# EasyEDA Pro project 2022年第十三届立创EDA出品模拟题.eprj

# Schematic 【蓝桥杯练习题一】51单片机开发板
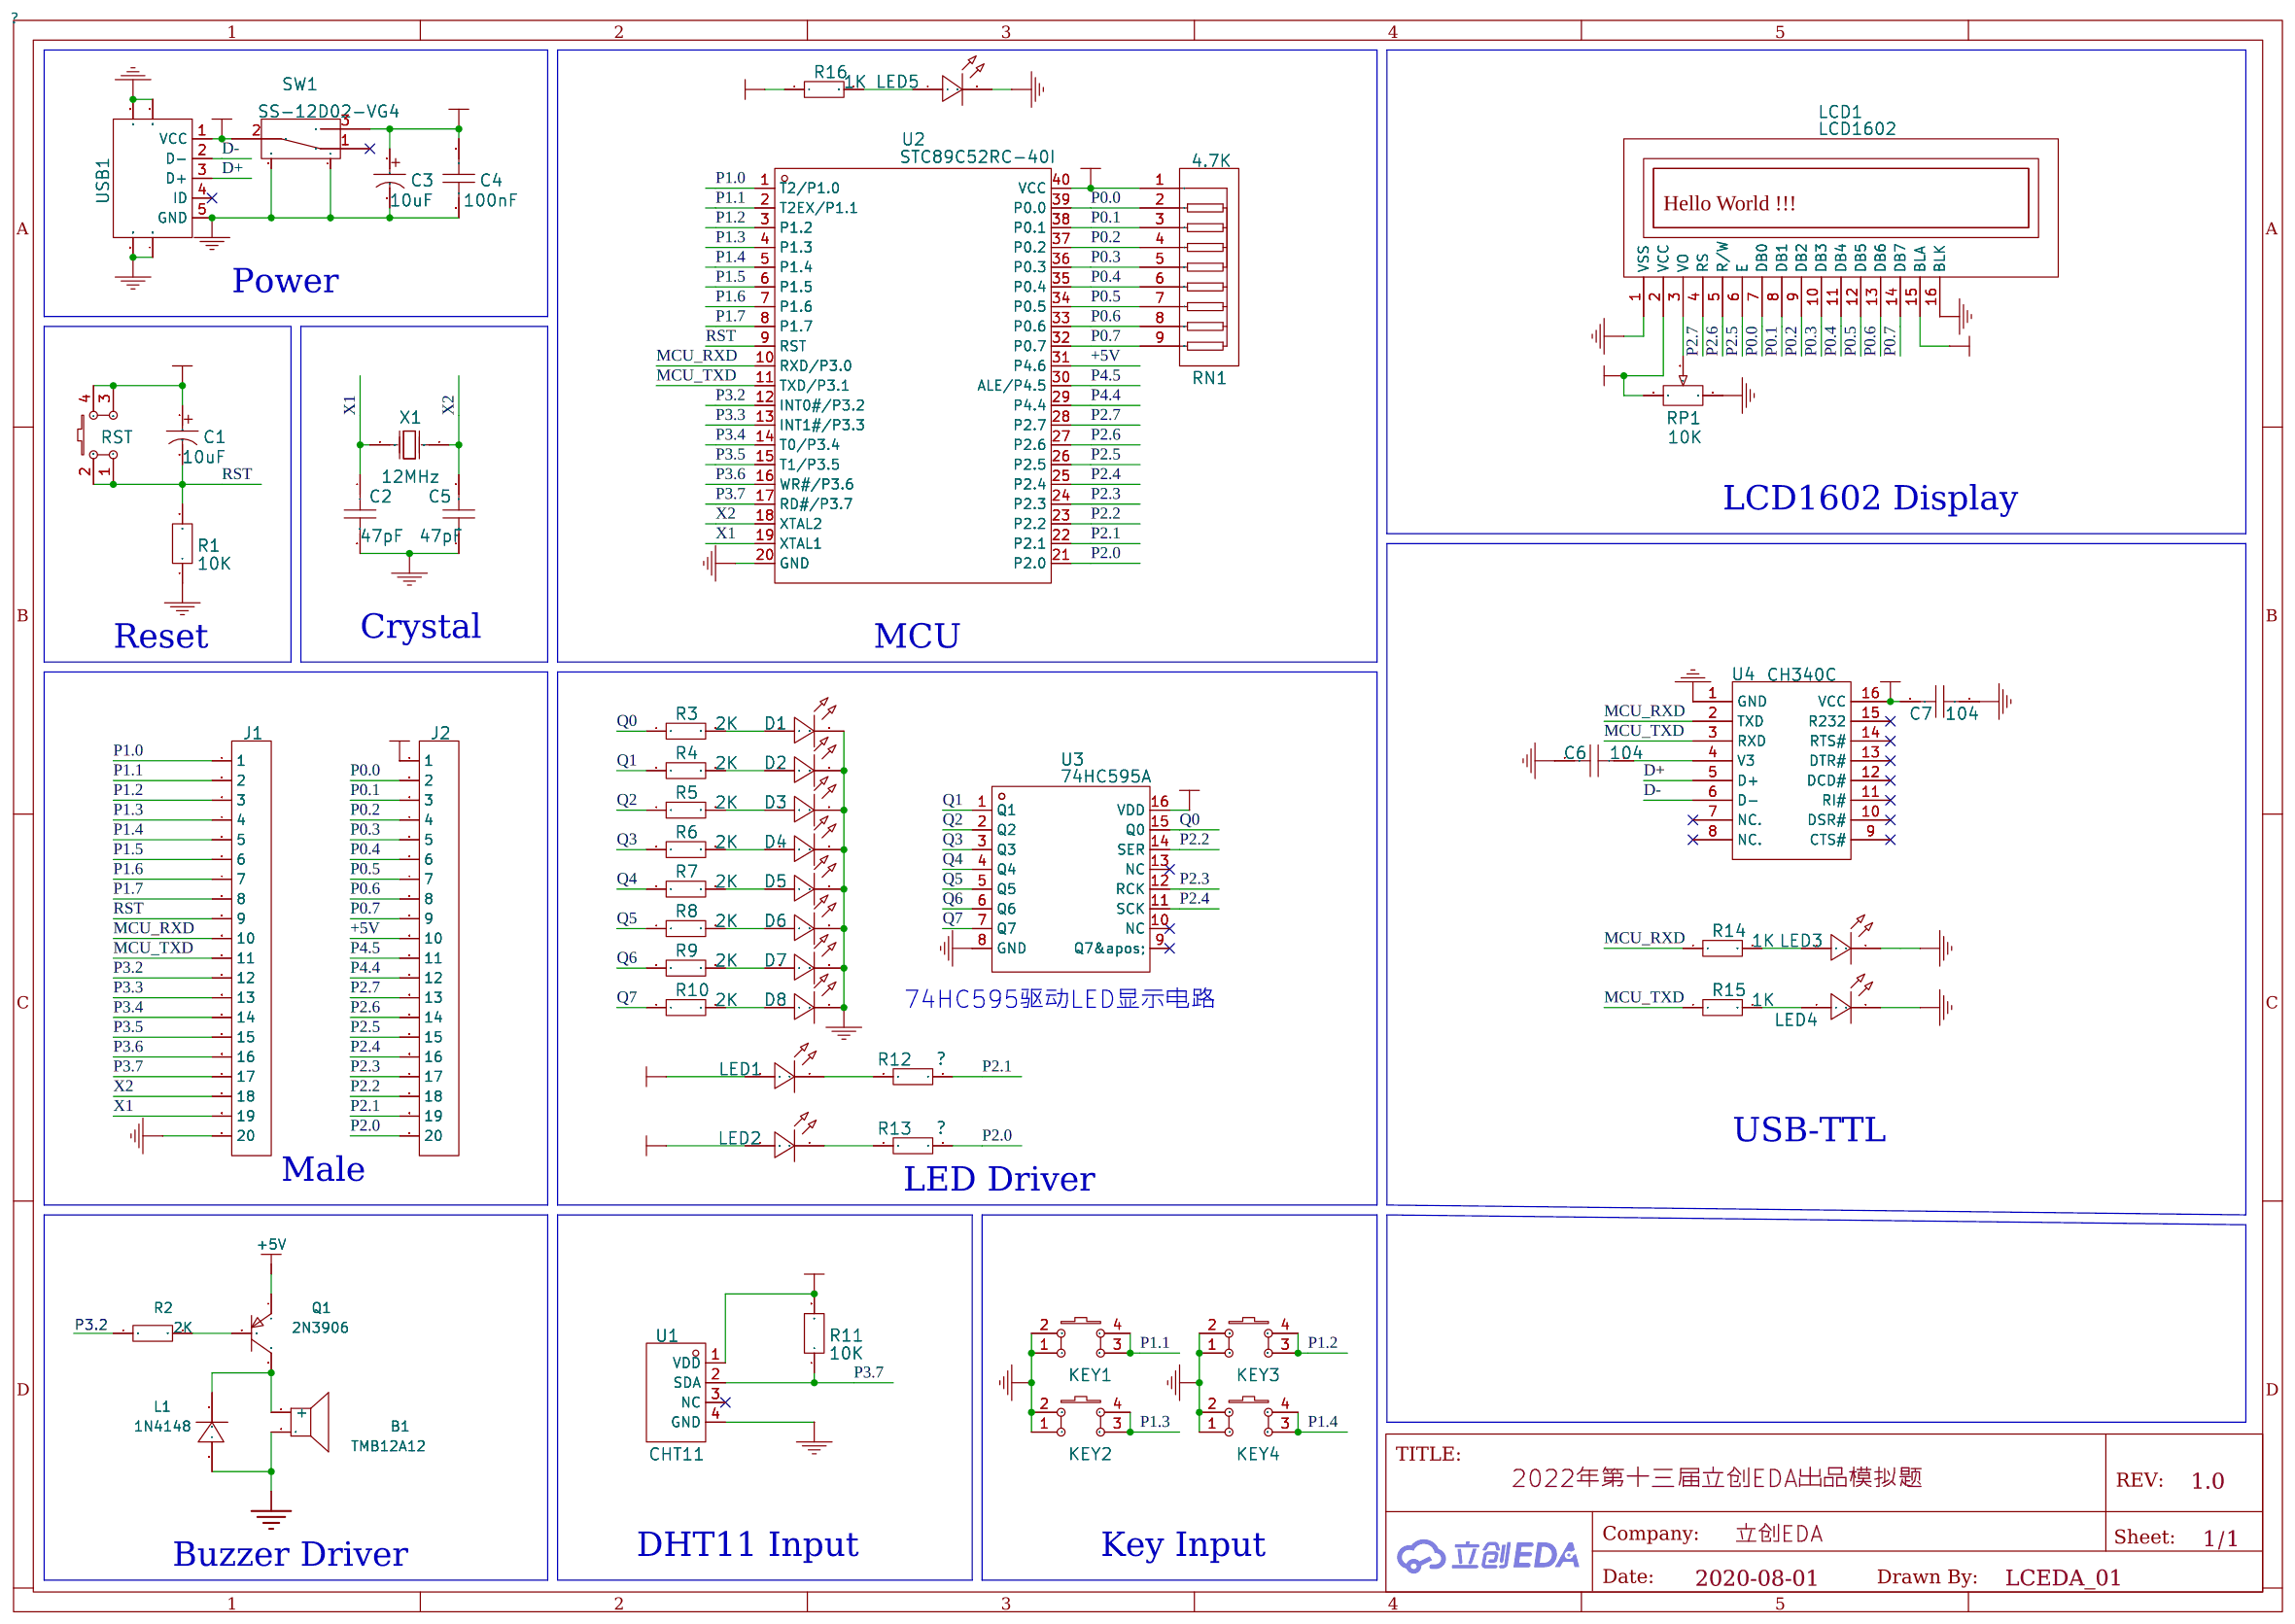
[diagram p0: schematic sheet]

## Parts
B1  TMB12A12  [BUZ-TH_BD12.0-P7.60-D0.6-FD]
C1  10uF  [CAP-TH_BD5.0-P2.00-D0.8-FD]
C2  47pF  [CAP-TH_L7.0-W3.0-P5.00-D0.9]
C3  10uF  [CAP-TH_BD5.0-P2.00-D0.8-FD]
C4  100nF  [CAP-TH_L5.0-W2.5-P2.54-D0.7]
C5  47pF  [CAP-TH_L7.0-W3.0-P5.00-D0.9]
C6  104  [C0805]
C7  104  [C0805]
D1  LED-0805_B  [LED0805_BLUE]
D2  LED-0805_B  [LED0805_BLUE]
D3  LED-0805_B  [LED0805_BLUE]
D4  LED-0805_B  [LED0805_BLUE]
D5  LED-0805_B  [LED0805_BLUE]
D6  LED-0805_B  [LED0805_BLUE]
D7  LED-0805_B  [LED0805_BLUE]
D8  LED-0805_B  [LED0805_BLUE]
J1  HDR-M-2.54_1x20  [HDR-M-2.54_1X20]
J2  HDR-M-2.54_1x20  [HDR-M-2.54_1X20]
KEY1  K4-6×6_SMD  [KEY-SMD_4P-L6.0-W6.0-P3.90-LS10.0]
KEY2  K4-6×6_SMD  [KEY-SMD_4P-L6.0-W6.0-P3.90-LS10.0]
KEY3  K4-6×6_SMD  [KEY-SMD_4P-L6.0-W6.0-P3.90-LS10.0]
KEY4  K4-6×6_SMD  [KEY-SMD_4P-L6.0-W6.0-P3.90-LS10.0]
L1  1N4148  [DO-35_BD2.0-L4.0-P8.00-D0.5-FD]
LCD1  LCD1602  [LCD1602]
LED1  LED-TH-3mm_B  [LED-TH_BD3.0_BLUE]
LED2  LED-TH-3mm_G  [LED-TH_BD3.0_GREEN]
LED3  LED-0805_B  [LED0805_BLUE]
LED4  LED-0805_G  [LED0805_GREEN]
LED5  LED-TH-3mm_R  [LED-TH_BD3.0_RED]
Q1  2N3906  [TO-92-3_L4.9-W3.7-P1.27-L]
R1  10K  [RES-TH_BD2.4-L6.3-P10.30-D0.6]
R2  2K  [RES-TH_BD2.4-L6.3-P10.30-D0.6]
R3  2K  [R0805]
R4  2K  [R0805]
R5  2K  [R0805]
R6  2K  [R0805]
R7  2K  [R0805]
R8  2K  [R0805]
R9  2K  [R0805]
R10  2K  [R0805]
R11  10K  [RES-TH_BD2.4-L6.3-P10.30-D0.6]
R12  ？  [RES-TH_BD2.4-L6.3-P10.30-D0.6]
R13  ？  [RES-TH_BD2.4-L6.3-P10.30-D0.6]
R14  1K  [R0805]
R15  1K  [R0805]
R16  1K  [RES-TH_BD2.4-L6.3-P10.30-D0.6]
RN1  4.7K  [RES-ARRAY-TH_9P-P2.54-D1.0]
RP1  10K  [RES-ADJ-TH_3296W]
RST  K4-6×6_SMD  [KEY-SMD_4P-L6.0-W6.0-P3.90-LS10.0]
SW1  SS-12D02-VG4  [SW-TH_SS-12D02-VG4]
U1  CHT11  [SENSOR-TH_DHT11]
U2  STC89C52RC-40I  [DIP-40_L52.0-W13.7-P2.54-LS15.2-BL]
U3  74HC595A  [SOIC-16_L9.9-W3.9-P1.27-LS6.0-BL]
U4  CH340C  [SOP-16_L10.0-W3.9-P1.27-LS6.0-BL]
USB1  USB-Micro_2  [MICRO-USB-SMD_5P_C40957]
X1  12MHz  [HC-49US_L11.5-W4.5-P4.88]

## Library data of the parts
B1 = TMB12A12
C1 C3 = 10uF 25V 5*11: Supplier: LCSC; Manufacturer: ValuePro; Supplier Part: C43347
C2 C5 = CC81-N5S2L1B470KSE: Supplier: LCSC; Supplier Part: C278007; Manufacturer: Guangdong Fenghua Advanced Tech
C4 C6 C7 = CC1H104ZA1FD3F5O10MF: Supplier: LCSC; Supplier Part: C254088; Manufacturer: Dersonic
D1-D8 LED3 = D-B080508B1-KS2: Manufacturer: 方舟 ARKLED; Supplier Part: C108412
J1 J2 = HDR-M-2.54_1x20: Supplier Part: C50981; Supplier: LCSC
KEY1-KEY4 RST = K2-6639SP-D4SC-04: Supplier Part: C191626; Supplier: LCSC; Manufacturer: 韩国韩荣
L1 = 1N4148
LCD1 = LCM1602K-NSW-BBW: Manufacturer: LONTECH(厦门龙特); Supplier Part: C83275; Supplier: LCSC
LED1 = 204-10SUBC/S400-A4: Manufacturer: EVERLIGHT(台湾亿光); Supplier Part: C86881; Supplier: LCSC
LED2 = 204-10SYGD/S530-E3: Manufacturer: EVERLIGHT(台湾亿光); Supplier Part: C85161
LED4 = NCD0805G1: Manufacturer: 国星光电; Supplier Part: C84260
LED5 = 204-10SDRD/S530-A3-L: Manufacturer: EVERLIGHT(台湾亿光); Supplier Part: C84774; Supplier: LCSC
Q1 = 2N3906
R1 R11 = RN 1/4W 10K F T/B A1: Supplier: LCSC; Supplier Part: C410695; Manufacturer: TyoHM
R2 = 2K
R3-R10 R14 R15 = ARG05FTC2001: Supplier: LCSC; Supplier Part: C218483; Manufacturer: Viking Tech; JLCPCB Part Class: Extended Part
R12 R13 R16 = RN1/2WS2KΩFT/BA1: Supplier: LCSC; Supplier Part: C385487; Manufacturer: TyoHM
RN1 = A09-472JP: Supplier: LCSC; Manufacturer: FH; Supplier Part: C9112
RP1 = 10K: Supplier: LCSC; Value(Ω): 10k
SW1 = SS-12D02-VG4: Supplier: LCSC; Supplier Part: C136719; Manufacturer: Rectangular Connectors - Contacts
U1 = CHT11: Supplier: LCSC; Supplier Part: C476208; Manufacturer: CYBERSEN; JLCPCB Part Class: Extended Part
U2 = STC89C52RC-40I: Supplier: LCSC; Manufacturer: STC; image: //image.lceda.cn/szlcsc/C14022.jpg; Supplier Part: C14022
U3 = 74HC595A: Supplier: LCSC; Manufacturer: FM; Supplier Part: C110383; JLCPCB Part Class: Extended Part
U4 = CH340C: Supplier: LCSC; Manufacturer: WCH; Supplier Part: C84681; JLCPCB Part Class: Extend
USB1 = USB-Micro_2: Supplier Part: C40957; Supplier: LCSC; Manufacturer: ValuePro
X1 = B12000J233: Supplier: LCSC; Supplier Part: C258979; Manufacturer: ZheJiang East Crystal Elec

## Nets
+5V: C1.1 C3.1 C4.2 J2.1 J2.10 LCD1.2(VCC) LCD1.15(BLA) LED1.1 LED2.1 Q1.1(E) R11.2 R16.1 RN1.1 RP1.1 RST.3 RST.4 SW1.3 U1.1(VDD) U2.31(P4.6) U2.40(VCC) U3.16(VDD)
GND: B1.2 C2.2 C3.2 C4.1 C5.1 C6.2 C7.1 D1.2 D2.2 D3.2 D4.2 D5.2 D6.2 D7.2 D8.2 J1.20 KEY1.1 KEY1.2 KEY2.1 KEY2.2 KEY3.1 KEY3.2 KEY4.1 KEY4.2 L1.1(A) LCD1.1(VSS) LCD1.16(BLK) LED3.2 LED4.2 LED5.2 R1.1 RP1.3 SW1.4 SW1.5 U1.4(GND) U2.20(GND) U3.8(GND) U4.1(GND) USB1.5(GND) USB1.6(SH3) USB1.7(SH4) USB1.8(SH1) USB1.9(SH2)
VCC: C7.2 SW1.2 U4.16(VCC) USB1.1(VCC)
D+: U4.5(D+) USB1.3(D+)
D-: U4.6(D-) USB1.2(D-)
MCU_RXD: J1.10 R14.1 U2.10(RXD/P3.0) U4.2(TXD)
MCU_TXD: J1.11 R15.1 U2.11(TXD/P3.1) U4.3(RXD)
P0.0: J2.2 LCD1.7(DB0) RN1.2 U2.39(P0.0)
P0.1: J2.3 LCD1.8(DB1) RN1.3 U2.38(P0.1)
P0.2: J2.4 LCD1.9(DB2) RN1.4 U2.37(P0.2)
P0.3: J2.5 LCD1.10(DB3) RN1.5 U2.36(P0.3)
P0.4: J2.6 LCD1.11(DB4) RN1.6 U2.35(P0.4)
P0.5: J2.7 LCD1.12(DB5) RN1.7 U2.34(P0.5)
P0.6: J2.8 LCD1.13(DB6) RN1.8 U2.33(P0.6)
P0.7: J2.9 LCD1.14(DB7) RN1.9 U2.32(P0.7)
P1.0: J1.1 U2.1(T2/P1.0)
P1.1: J1.2 KEY1.3 KEY1.4 U2.2(T2EX/P1.1)
P1.2: J1.3 KEY3.3 KEY3.4 U2.3(P1.2)
P1.3: J1.4 KEY2.3 KEY2.4 U2.4(P1.3)
P1.4: J1.5 KEY4.3 KEY4.4 U2.5(P1.4)
P1.5: J1.6 U2.6(P1.5)
P1.6: J1.7 U2.7(P1.6)
P1.7: J1.8 U2.8(P1.7)
P2.0: J2.20 R13.2 U2.21(P2.0)
P2.1: J2.19 R12.2 U2.22(P2.1)
P2.2: J2.18 U2.23(P2.2) U3.14(SER)
P2.3: J2.17 U2.24(P2.3) U3.12(RCK)
P2.4: J2.16 U2.25(P2.4) U3.11(SCK)
P2.5: J2.15 LCD1.6(E) U2.26(P2.5)
P2.6: J2.14 LCD1.5(R/W) U2.27(P2.6)
P2.7: J2.13 LCD1.4(RS) U2.28(P2.7)
P3.2: J1.12 R2.1 U2.12(INT0#/P3.2)
P3.3: J1.13 U2.13(INT1#/P3.3)
P3.4: J1.14 U2.14(T0/P3.4)
P3.5: J1.15 U2.15(T1/P3.5)
P3.6: J1.16 U2.16(WR#/P3.6)
P3.7: J1.17 R11.1 U1.2(SDA) U2.17(RD#/P3.7)
P4.4: J2.12 U2.29(P4.4)
P4.5: J2.11 U2.30(ALE/P4.5)
Q0: R3.1 U3.15(Q0)
Q1: R4.1 U3.1(Q1)
Q2: R5.1 U3.2(Q2)
Q3: R6.1 U3.3(Q3)
Q4: R7.1 U3.4(Q4)
Q5: R8.1 U3.5(Q5)
Q6: R9.1 U3.6(Q6)
Q7: R10.1 U3.7(Q7)
RST: C1.2 J1.9 R1.2 RST.1 RST.2 U2.9(RST)
X1: C2.1 J1.19 U2.19(XTAL1) X1.2(OSC2)
X2: C5.2 J1.18 U2.18(XTAL2) X1.1(OSC1)
$1N507: LCD1.3(VO) RP1.2
$1N544: D1.1 R3.2
$1N555: D2.1 R4.2
$1N566: D3.1 R5.2
$1N577: D4.1 R6.2
$1N588: D5.1 R7.2
$1N599: D6.1 R8.2
$1N610: D7.1 R9.2
$1N621: D8.1 R10.2
$1N777: C6.1 U4.4(V3)
$1N811: LED3.1 R14.2
$1N822: LED4.1 R15.2
$1N842: LED2.2 R13.1
$1N843: LED1.2 R12.1
$1N921: LED5.1 R16.2
$1N2085: Q1.2(B) R2.2
$1N2102: B1.1(+) L1.2(C) Q1.3(C)

Not connected (* = marked no-connect by the designer): SW1 1*; U1 3(NC)*; U3 9(Q7&apos;)* 10(NC)* 13(NC)*; U4 7(NC.)* 8(NC.)* 9(CTS#)* 10(DSR#)* 11(RI#)* 12(DCD#)* 13(DTR#)* 14(RTS#)* 15(R232)*; USB1 4(ID)*

## Notes on the sheet
- Power
- LCD1602 Display
- Reset
- Crystal
- MCU
- 74HC595驱动LED显示电路
- USB-TTL
- Male
- LED Driver
- DHT11 Input
- Key Input
- Buzzer Driver

# Board PCB
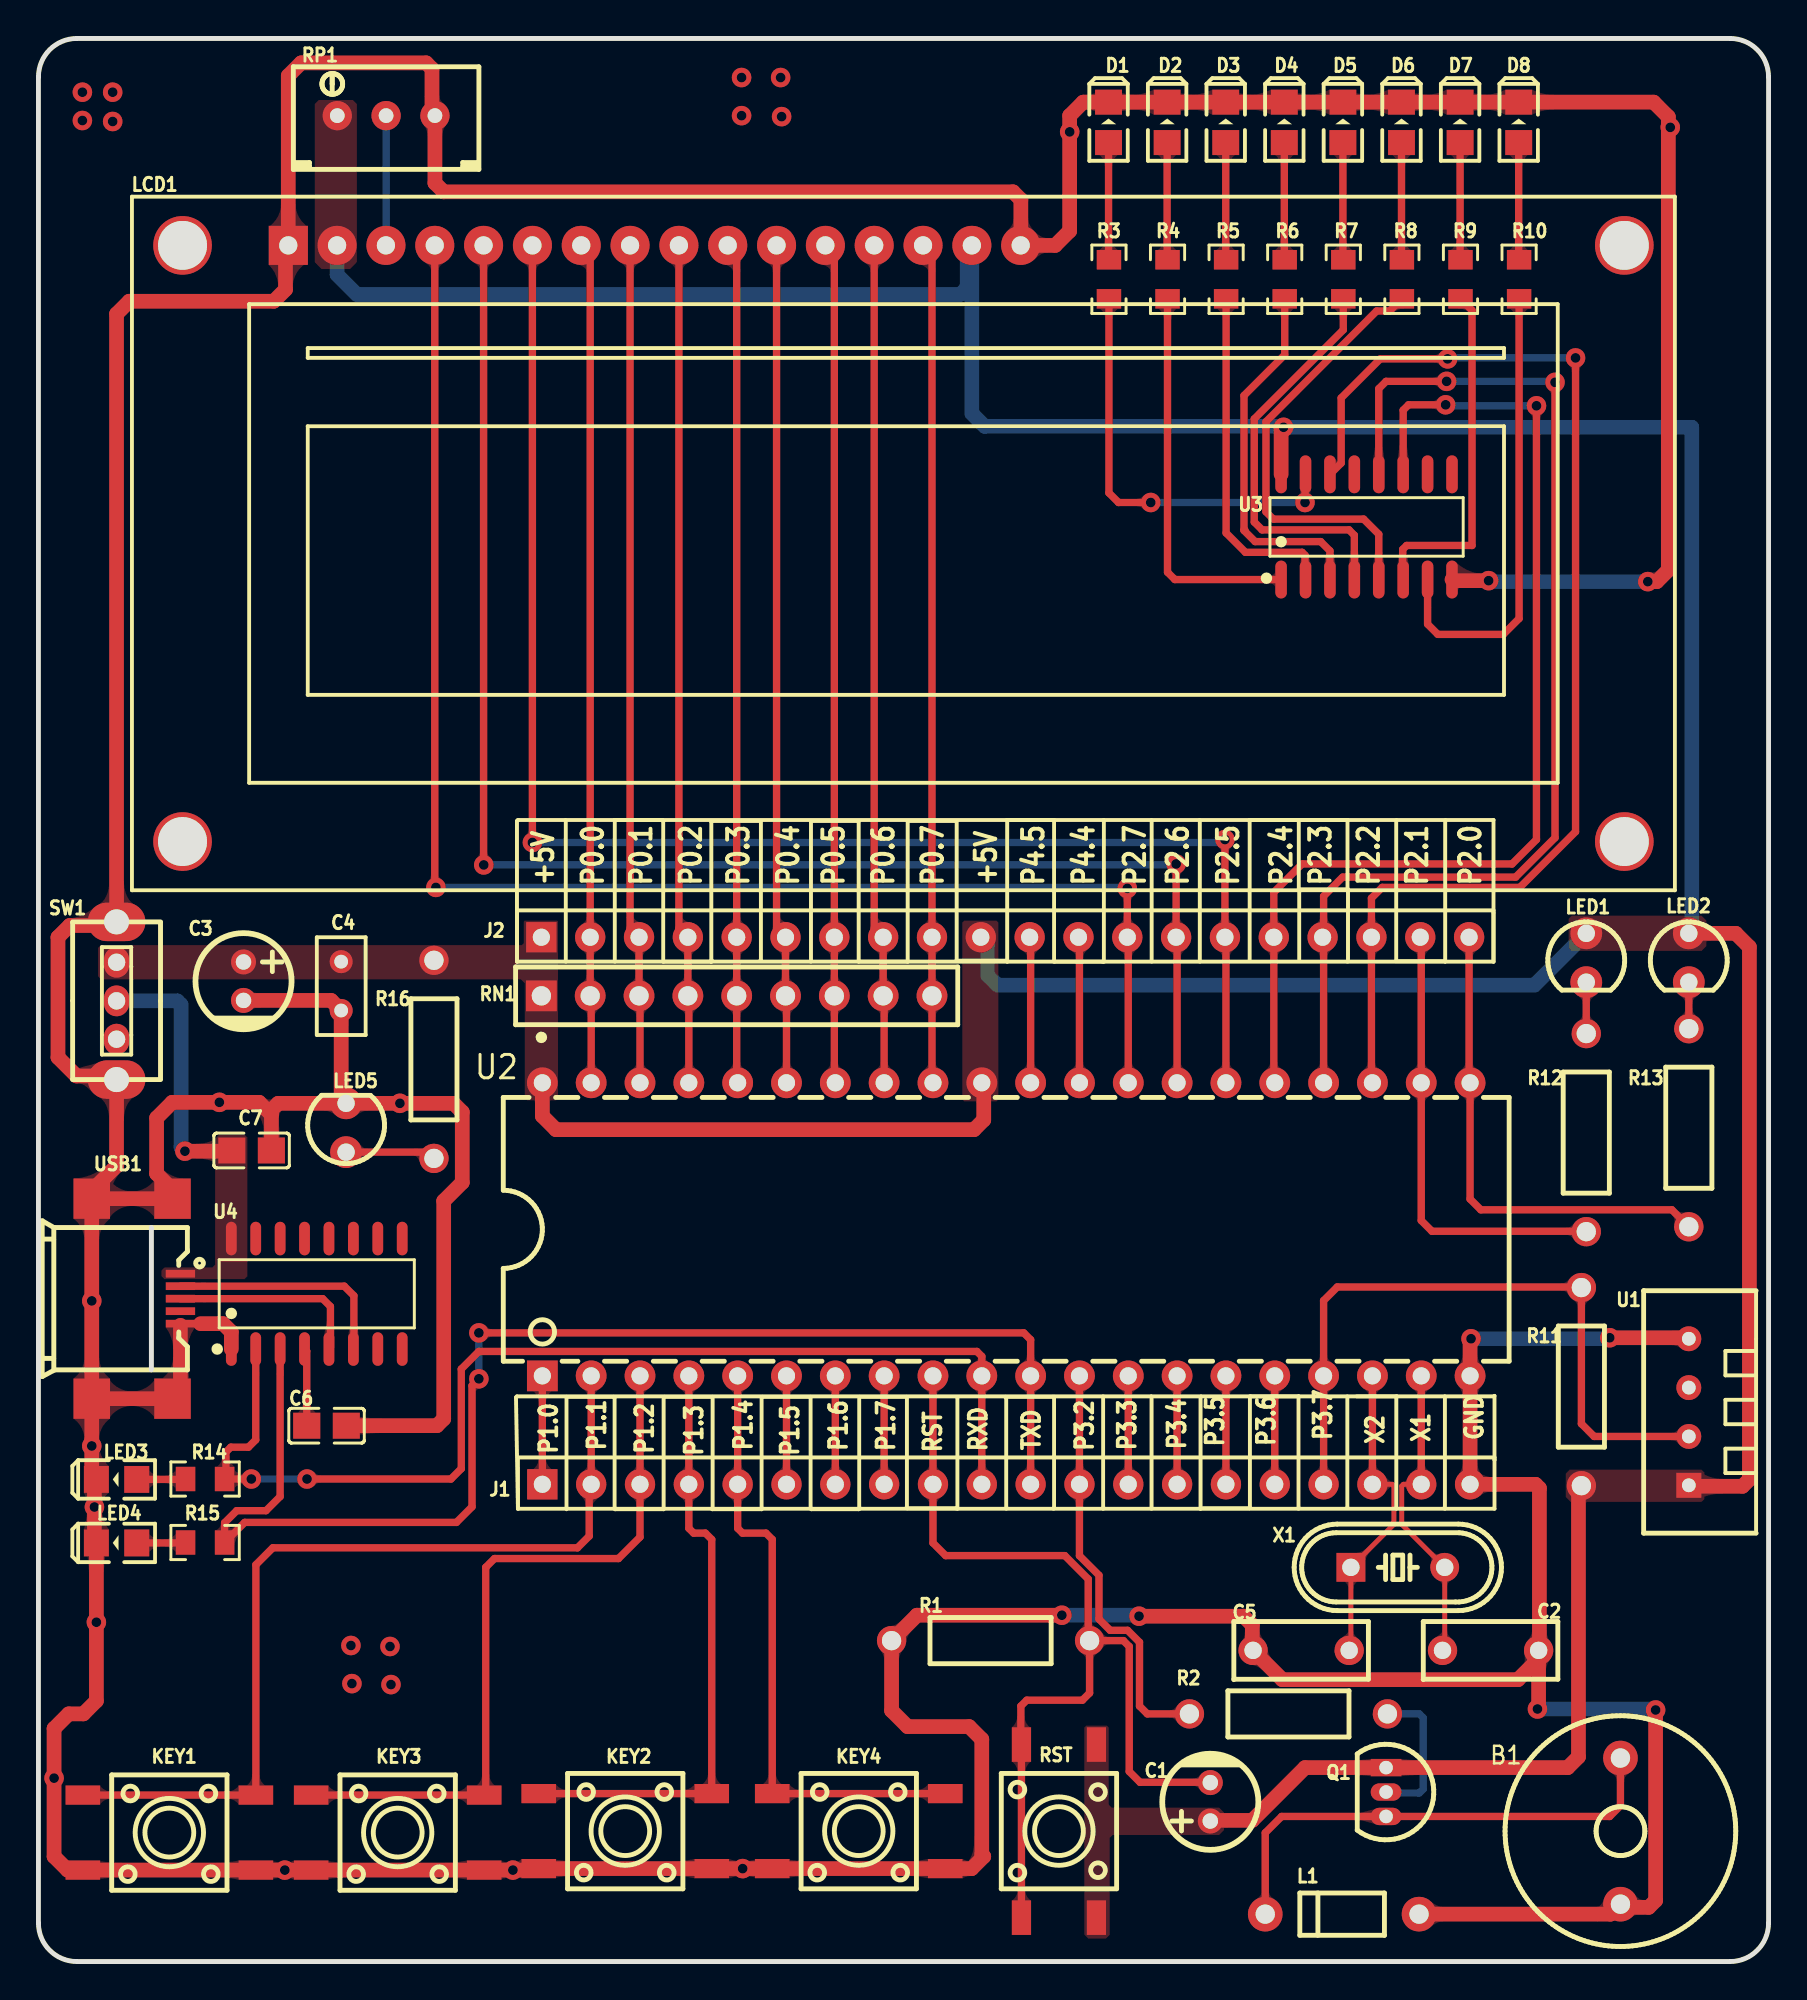
[diagram p1: board, top side]
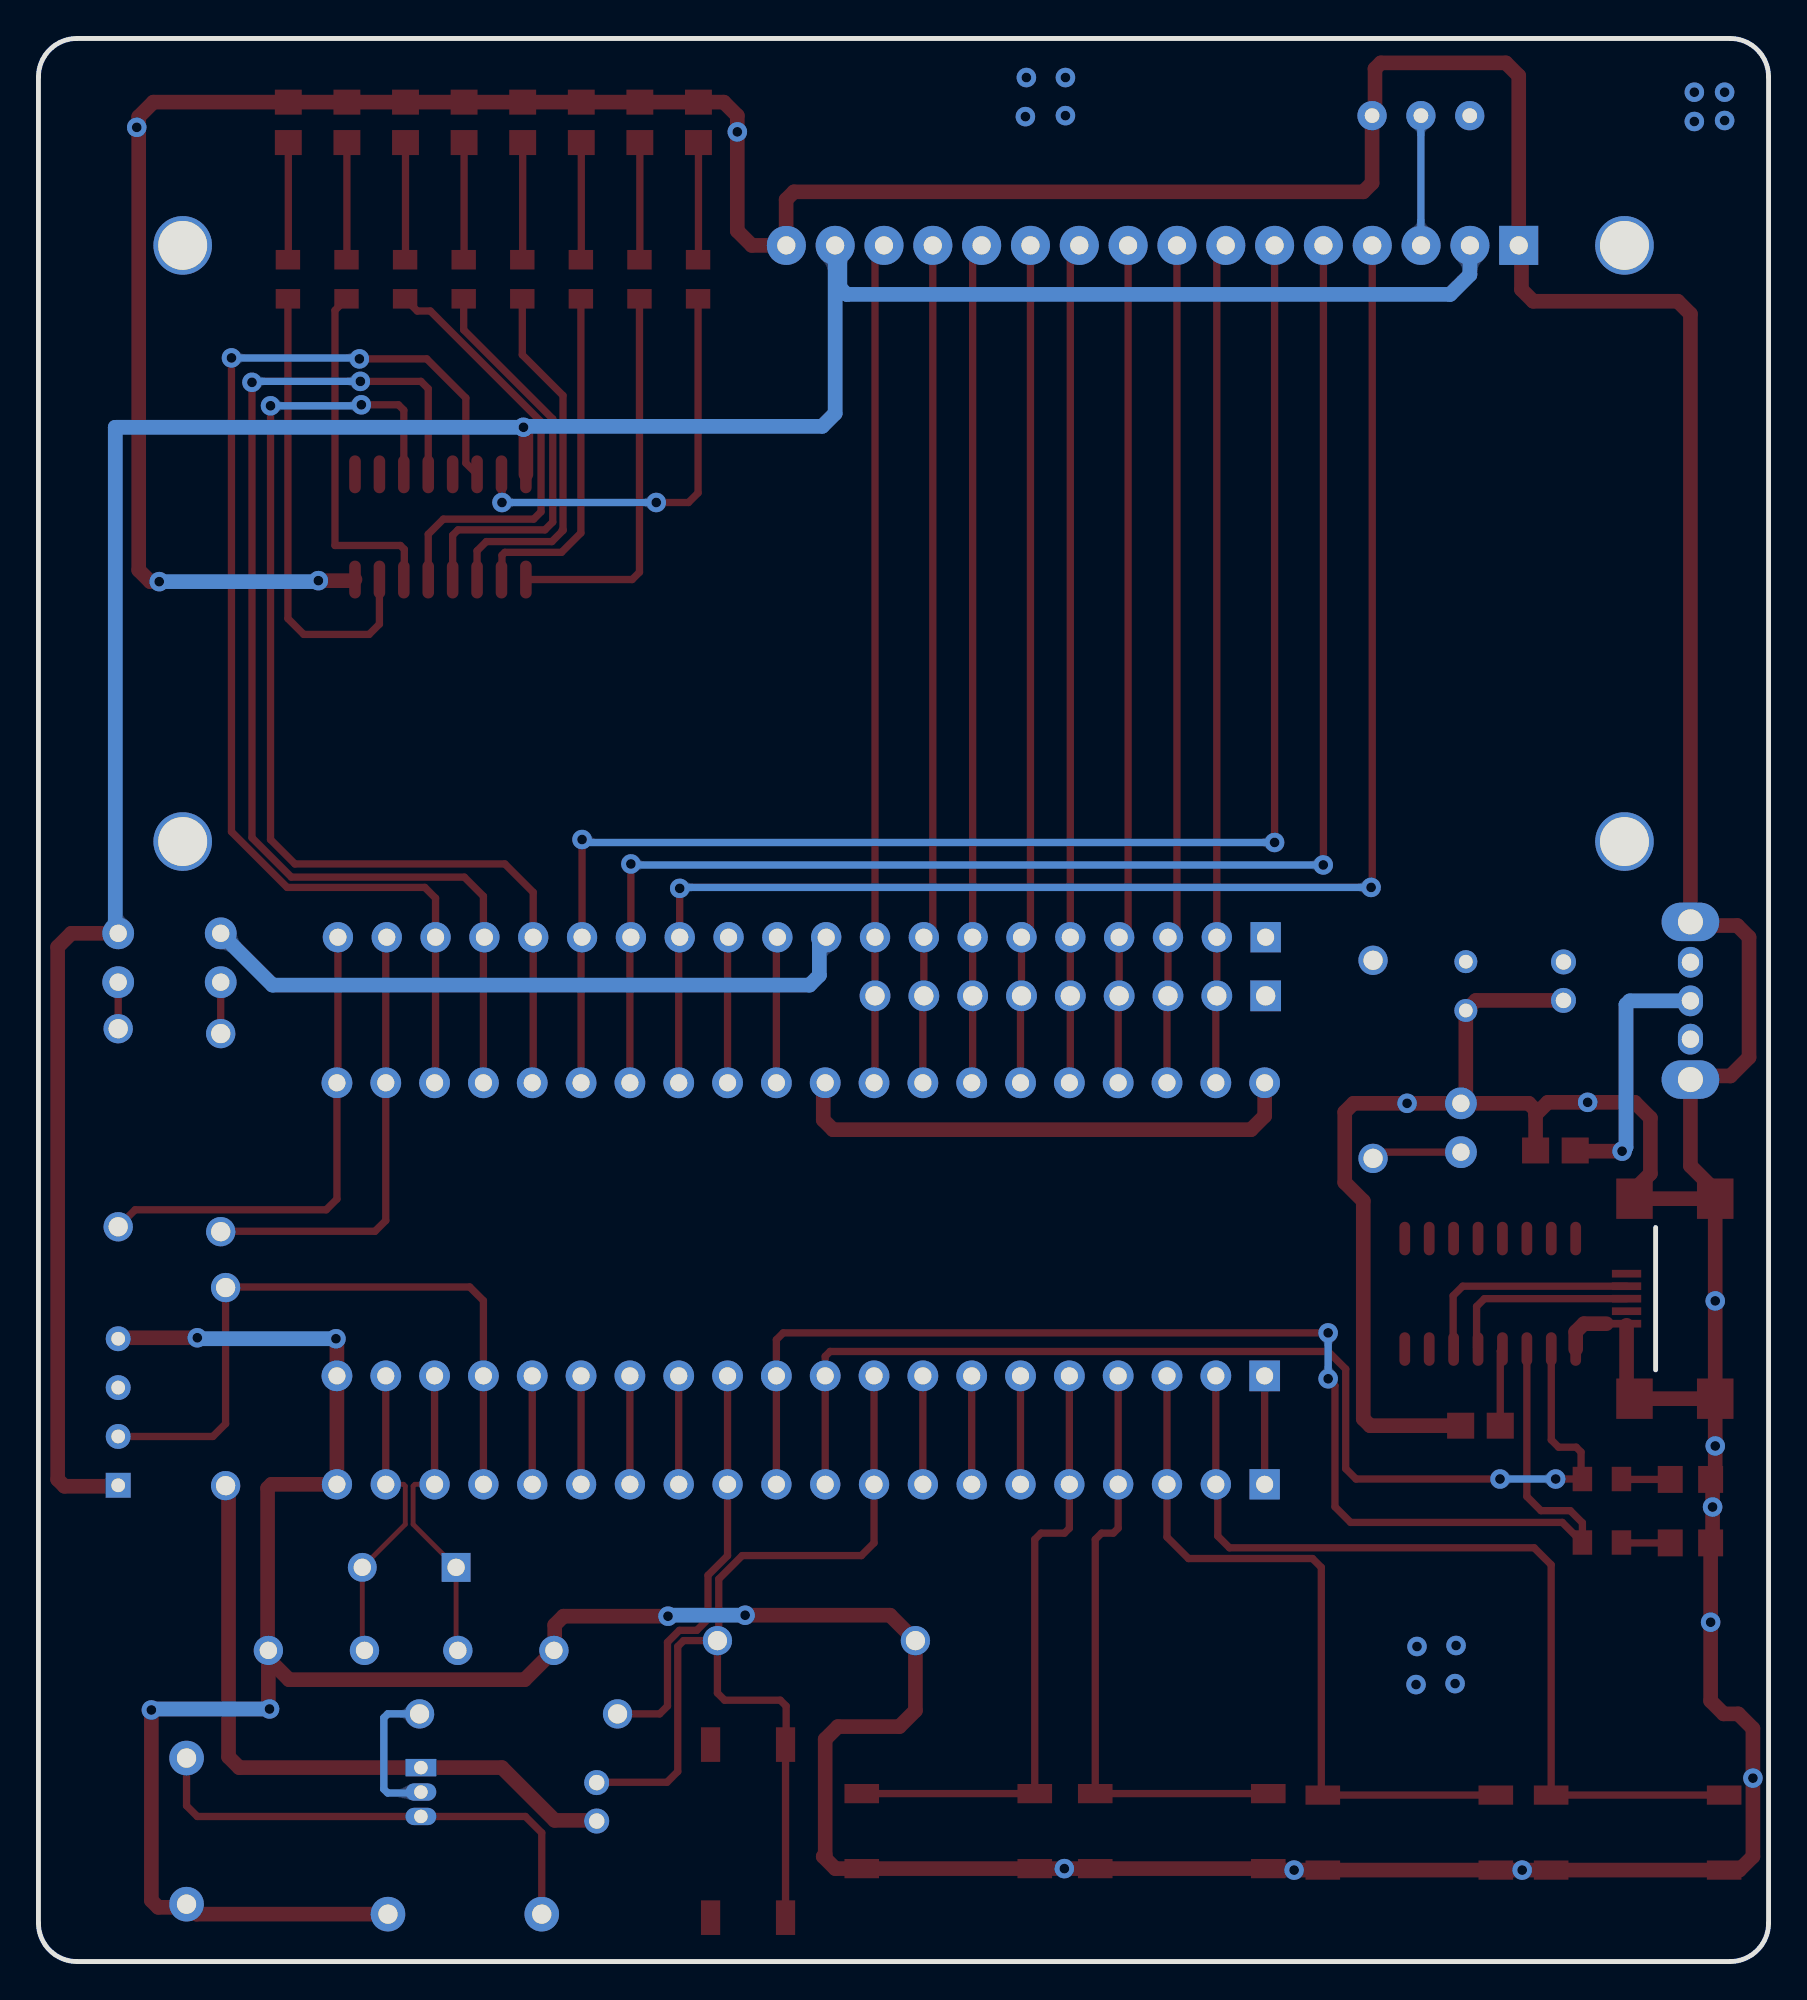
[diagram p2: board, bottom side, seen from below]

Outline 90 x 100 mm; copper layers: Top Layer, Bottom Layer. Coordinates in mm from the lower left corner of the outline.
Outline path: 0,98 arc(0.59,99.41) 2,100 88,100 arc(89.41,99.41) 90,98 90,2 arc(89.41,0.59) 88,0 2,0 arc(0.59,0.59) 0,2 0,98
Stack: Top Layer 0.035mm / Dielectric1 1.51mm FR4 er 4.5 / Bottom Layer 0.035mm

## Design rules (mm)
net X1: DP1
net X2: DP1
template: 用户自定义配置
spacing Default (default): track to track 0.152, other pairs 0 to 0.152
track width Default (default): min 0.381, default 0.381, max 25.4
track width PWR: min 0.762, default 0.762, max 2.54
differential pair differentialPair (default): width min 0.127, default 0.254, max 2.54; gap min 0.152, default 0.152
via Default (default): diameter min 1.016, default 1.016, max 100.025; hole min 0.508, default 0.508, max 59.995
net VCC uses PWR
net GND uses PWR
net +5V uses PWR

## Placement (name value [footprint] x y rotation side)
B1  TMB12A12  [BUZ-TH_BD12.0-P7.60-D0.6-FD]  82.3 6.78 270 top
C1  10uF  [CAP-TH_BD5.0-P2.00-D0.8-FD]  60.96 8.31 90 top
C2  47pF  [CAP-TH_L7.0-W3.0-P5.00-D0.9]  75.54 16.18 0 top
C3  10uF  [CAP-TH_BD5.0-P2.00-D0.8-FD]  10.67 50.98 270 top
C4  100nF  [CAP-TH_L5.0-W2.5-P2.54-D0.7]  15.75 50.72 90 top
C5  47pF  [CAP-TH_L7.0-W3.0-P5.00-D0.9]  65.68 16.18 0 top
C6  104  [C0805]  14.99 27.86 0 top
C7  104  [C0805]  11.09 42.18 180 top
D1  LED-0805_B  [LED0805_BLUE]  55.67 95.64 90 top
D2  LED-0805_B  [LED0805_BLUE]  58.71 95.64 90 top
D3  LED-0805_B  [LED0805_BLUE]  61.76 95.64 90 top
D4  LED-0805_B  [LED0805_BLUE]  64.81 95.64 90 top
D5  LED-0805_B  [LED0805_BLUE]  67.86 95.64 90 top
D6  LED-0805_B  [LED0805_BLUE]  70.91 95.64 90 top
D7  LED-0805_B  [LED0805_BLUE]  73.95 95.64 90 top
D8  LED-0805_B  [LED0805_BLUE]  77 95.64 90 top
J1  HDR-M-2.54_1x20  [HDR-M-2.54_1X20]  50.34 24.82 0 top
J2  HDR-M-2.54_1x20  [HDR-M-2.54_1X20]  50.29 53.26 0 top
KEY1  K4-6×6_SMD  [KEY-SMD_4P-L6.0-W6.0-P3.90-LS10.0]  6.81 6.71 180 top
KEY2  K4-6×6_SMD  [KEY-SMD_4P-L6.0-W6.0-P3.90-LS10.0]  30.52 6.78 180 top
KEY3  K4-6×6_SMD  [KEY-SMD_4P-L6.0-W6.0-P3.90-LS10.0]  18.69 6.71 180 top
KEY4  K4-6×6_SMD  [KEY-SMD_4P-L6.0-W6.0-P3.90-LS10.0]  42.67 6.78 180 top
L1  1N4148  [DO-35_BD2.0-L4.0-P8.00-D0.5-FD]  67.82 2.46 180 top
LCD1  -  [LCD1602]  45 73.74 0 top
LED1  LED-TH-3mm_B  [LED-TH_BD3.0_BLUE]  80.52 52.2 0 top
LED2  LED-TH-3mm_G  [LED-TH_BD3.0_GREEN]  85.85 52.2 0 top
LED3  LED-0805_B  [LED0805_BLUE]  4.06 25.07 180 top
LED4  LED-0805_G  [LED0805_GREEN]  4.06 21.77 180 top
LED5  LED-TH-3mm_R  [LED-TH_BD3.0_RED]  16 43.36 180 top
Q1  2N3906  [TO-92-3_L4.9-W3.7-P1.27-L]  70.1 8.81 270 top
R1  10K  [RES-TH_BD2.4-L6.3-P10.30-D0.6]  49.53 16.69 0 top
R2  2K  [RES-TH_BD2.4-L6.3-P10.30-D0.6]  65.02 12.88 0 top
R3  2K  [R0805]  55.67 86.49 90 top
R4  2K  [R0805]  58.71 86.49 90 top
R5  2K  [R0805]  61.76 86.49 90 top
R6  2K  [R0805]  64.81 86.49 90 top
R7  2K  [R0805]  67.86 86.49 90 top
R8  2K  [R0805]  70.91 86.49 90 top
R9  2K  [R0805]  73.95 86.49 90 top
R10  2K  [R0805]  77 86.49 90 top
R11  10K  [RES-TH_BD2.4-L6.3-P10.30-D0.6]  80.26 29.9 270 top
R12  ？  [RES-TH_BD2.4-L6.3-P10.30-D0.6]  80.52 43.1 270 top
R13  ？  [RES-TH_BD2.4-L6.3-P10.30-D0.6]  85.85 43.36 270 top
R14  1K  [R0805]  9.65 25.07 180 top
R15  1K  [R0805]  9.65 21.77 180 top
R16  1K  [RES-TH_BD2.4-L6.3-P10.30-D0.6]  20.57 46.91 270 top
RN1  4.7K  [RES-ARRAY-TH_9P-P2.54-D1.0]  36.32 50.22 0 top
RP1  10K  [RES-ADJ-TH_3296W]  18.08 95.99 90 top
RST  K4-6×6_SMD  [KEY-SMD_4P-L6.0-W6.0-P3.90-LS10.0]  53.09 6.78 90 top
SW1  SS-12D02-VG4  [SW-TH_SS-12D02-VG4]  4.06 49.96 90 top
U1  CHT11  [SENSOR-TH_DHT11]  85.85 28.57 90 top
U2  STC89C52RC-40I  [DIP-40_L52.0-W13.7-P2.54-LS15.2-BL]  50.34 38.08 0 top
U3  74HC595A  [SOIC-16_L9.9-W3.9-P1.27-LS6.0-BL]  69.09 74.6 0 top
U4  CH340C  [SOP-16_L10.0-W3.9-P1.27-LS6.0-BL]  14.48 34.72 0 top
USB1  USB-Micro_2  [MICRO-USB-SMD_5P_C40957]  5.08 34.47 270 top
X1  12MHz  [HC-49US_L11.5-W4.5-P4.88]  70.71 20.5 0 top

## Footprints (pads in the part's own frame, mm; a bottom-side part is the same pattern mirrored in y, then rotated)
BUZ-TH_BD12.0-P7.60-D0.6-FD
  round 1.8 hole 1.005x1: 1(-3.8,0) 2(3.8,0)
C0805
  rect 1.41x1.35 smd: 1(-1.03,0) 2(1.03,0)
CAP-TH_BD5.0-P2.00-D0.8-FD
  round 1.3 hole 0.8: 1(-1,0) 2(1,0)
CAP-TH_L5.0-W2.5-P2.54-D0.7
  round 1.194 hole 0.711: 1(-1.27,0) 2(1.27,0)
CAP-TH_L7.0-W3.0-P5.00-D0.9
  round 1.524 hole 0.9: 1(-2.5,0) 2(2.5,0)
DIP-40_L52.0-W13.7-P2.54-LS15.2-BL
  rect 1.6x1.6 hole 0.889: 1(-24.13,-7.62)
  round 1.6 hole 0.889: 2(-21.59,-7.62) 3(-19.05,-7.62) 4(-16.51,-7.62) 5(-13.97,-7.62) 6(-11.43,-7.62) 7(-8.89,-7.62) 8(-6.35,-7.62) 9(-3.81,-7.62) 10(-1.27,-7.62) 11(1.27,-7.62) 12(3.81,-7.62) 13(6.35,-7.62) 14(8.89,-7.62) 15(11.43,-7.62) 16(13.97,-7.62) 17(16.51,-7.62) 18(19.05,-7.62) 19(21.59,-7.62) 20(24.13,-7.62) 21(24.13,7.62) 22(21.59,7.62) 23(19.05,7.62) 24(16.51,7.62) 25(13.97,7.62) 26(11.43,7.62) 27(8.89,7.62) 28(6.35,7.62) 29(3.81,7.62) 30(1.27,7.62) 31(-1.27,7.62) 32(-3.81,7.62) 33(-6.35,7.62) 34(-8.89,7.62) 35(-11.43,7.62) 36(-13.97,7.62) 37(-16.51,7.62) 38(-19.05,7.62) 39(-21.59,7.62) 40(-24.13,7.62)
DO-35_BD2.0-L4.0-P8.00-D0.5-FD
  round 1.8 hole 1: 1(-4,0) 2(4,0)
HC-49US_L11.5-W4.5-P4.88
  rect 1.5x1.5 hole 0.9: 1(-2.44,0)
  round 1.5 hole 0.9: 2(2.44,0)
HDR-M-2.54_1X20
  rect 1.575x1.575 hole 0.889: 1(-24.13,0)
  round 1.575 hole 0.889: 2(-21.59,0) 3(-19.05,0) 4(-16.51,0) 5(-13.97,0) 6(-11.43,0) 7(-8.89,0) 8(-6.35,0) 9(-3.81,0) 10(-1.27,0) 11(1.27,0) 12(3.81,0) 13(6.35,0) 14(8.89,0) 15(11.43,0) 16(13.97,0) 17(16.51,0) 18(19.05,0) 19(21.59,0) 20(24.13,0)
KEY-SMD_4P-L6.0-W6.0-P3.90-LS10.0
  rect 1.8x1 smd: 1(-4.5,1.95) 2(4.5,1.95) 3(-4.5,-1.95) 4(4.5,-1.95)
LCD1602
  round 3.048 hole 2.545x2.54: 0(-37.5,15.5) 17(-37.5,-15.5) 18(37.5,15.5) 19(37.5,-15.5)
  rect 2.032x2.032 hole 0.945: 1(-32,15.5)
  round 2.032 hole 0.945: 2(-29.46,15.5) 3(-26.92,15.5) 4(-24.38,15.5) 5(-21.84,15.5) 6(-19.3,15.5) 7(-16.76,15.5) 8(-14.22,15.5) 9(-11.68,15.5) 10(-9.14,15.5) 11(-6.6,15.5) 12(-4.06,15.5) 13(-1.52,15.5) 14(1.02,15.5) 15(3.56,15.5) 16(6.1,15.5)
LED0805_BLUE
  rect 1.3x1.399 smd: 1(-1.05,0) 2(1.05,0)
LED0805_GREEN
  rect 1.3x1.399 smd: 1(-1.05,0) 2(1.05,0)
LED-TH_BD3.0_BLUE
  round 1.651 hole 0.9: 1(0,1.27) 2(0,-1.27)
LED-TH_BD3.0_GREEN
  round 1.651 hole 0.9: 1(0,1.27) 2(0,-1.27)
LED-TH_BD3.0_RED
  round 1.651 hole 0.9: 1(0,1.27) 2(0,-1.27)
MICRO-USB-SMD_5P_C40957
  rect 0.4x1.524 smd: 1(-1.3,2.306) 2(-0.65,2.306) 3(0,2.306) 4(0.65,2.306) 5(1.3,2.306)
  rect 2.1x1.9 smd: 6(5.2,1.894) 7(5.2,-2.306) 8(-5.2,-2.306) 9(-5.2,1.894)
R0805
  rect 1.016x1.27 smd: 1(-0.032,-0.021) 2(2,-0.021)
RES-ADJ-TH_3296W
  round 1.524 hole 0.762: 1(0,2.54) 2(0,0) 3(0,-2.54)
RES-ARRAY-TH_9P-P2.54-D1.0
  rect 1.6x1.6 hole 1: 1(-10.16,0)
  round 1.6 hole 1: 2(-7.62,0) 3(-5.08,0) 4(-2.54,0) 5(0,0) 6(2.54,0) 7(5.08,0) 8(7.62,0) 9(10.16,0)
RES-TH_BD2.4-L6.3-P10.30-D0.6
  round 1.524 hole 1: 1(-5.15,0) 2(5.15,0)
SENSOR-TH_DHT11
  rect 1.296x1.296 hole 0.711: 1(-3.81,0)
  round 1.296 hole 0.711: 2(-1.27,0) 3(1.27,0) 4(3.81,0)
SOIC-16_L9.9-W3.9-P1.27-LS6.0-BL
  oval 0.602x1.971 smd: 1(-4.445,-2.736) 2(-3.175,-2.736) 3(-1.905,-2.736) 4(-0.635,-2.736) 5(0.635,-2.736) 6(1.905,-2.736) 7(3.175,-2.736) 8(4.445,-2.736) 9(4.445,2.736) 10(3.175,2.736) 11(1.905,2.736) 12(0.635,2.736) 13(-0.635,2.736) 14(-1.905,2.736) 15(-3.175,2.736) 16(-4.445,2.736)
SOP-16_L10.0-W3.9-P1.27-LS6.0-BL
  oval 0.56x1.745 smd: 1(-4.445,-2.873) 2(-3.175,-2.873) 3(-1.905,-2.873) 4(-0.635,-2.873) 5(0.635,-2.873) 6(1.905,-2.873) 7(3.175,-2.873) 8(4.445,-2.873) 9(4.445,2.873) 10(3.175,2.873) 11(1.905,2.873) 12(0.635,2.873) 13(-0.635,2.873) 14(-1.905,2.873) 15(-3.175,2.873) 16(-4.445,2.873)
SW-TH_SS-12D02-VG4
  oval 1.6x1.3 hole 0.9: 1(-2,0) 2(-0.006,0) 3(2,0)
  oval 2x3 hole 1.3: 4(4.1,0) 5(-4.1,0)
TO-92-3_L4.9-W3.7-P1.27-L
  rect 0.9x1.6 hole 0.7: 1(-1.27,0)
  oval 0.9x1.6 hole 0.7: 2(0,0) 3(1.27,0)

## Nets
As in the schematic.

Pads without a net: LCD1 0 17 18 19; SW1 1; U1 3; U3 9 10 13; U4 7 8 9 10 11 12 13 14 15; USB1 4

## Via types
v1: diameter 1.016, hole 0.508, Top Layer to Bottom Layer, 52 vias

## Routing (per net, layer and track width the routed paths; a pad name or vN(x,y) marks a point on that pad's centre or on a via; arc(x,y) is an arc through that point)
+5V: length 243.4
  Top Layer w0.762: v1(64.77,79.78) 64.64,79.65 U3.16 ; LED2.1 88.29,53.47 89,52.76 89,25.07 88.65,24.71 85.9,24.71 U1.1 ; C1.1 61,7.34 63.14,7.34 65.89,10.08 Q1.1 79.55,10.08 80.11,10.64 80.11,24.59 R11.2 ; U2.40 26.21,43.97 26.92,43.26 48.67,43.26 49.17,43.76 49.17,45.59 U2.31
  Bottom Layer w0.762: LED2.1 86,53.62 86,79.78 v1(64.77,79.78) 64.72,79.83 49.22,79.83 48.56,80.5 LCD1.15 48.31,89 48.31,87.05 47.96,86.69 16.56,86.69 15.54,87.72 LCD1.2 ; LED1.1 77.83,50.78 49.89,50.78 49.38,51.28 49.38,52.91 J2.10
GND: length 464.7
  Top Layer w0.762: 12.12,44.04 12.12,44.27 12.47,44.63 LED5.2 ; 12.12,44.04 C7.1 ; 12.12,44.04 11.48,44.68 v1(9.41,44.68) 6.96,44.68 6.15,43.87 6.15,40.97 6.97,40.14 USB1.9 USB1.8 ; v1(81.74,32.44) 85.8,32.44 U1.4 ; U3.8 73.59,71.81 v1(75.44,71.81) ; 78.04,15.73 76.96,14.66 64.71,14.66 C5.1 63.14,16.22 63.14,17.5 62.69,17.96 v1(57.25,17.96) ; 78.04,15.73 78.04,13.19 v1(77.98,13.13) ; 78.04,15.73 C2.2 78.08,16.22 78.08,24.61 77.88,24.82 J1.20 U2.20 74.47,32.33 v1(74.52,32.39) ; USB1.7 USB1.6 7.39,29.68 7.39,33.08 ; USB1.7 2.77,25.31 LED3.2 2.91,24.97 v1(2.91,23.64) 2.91,21.87 LED4.2 v1(3.01,17.64) 3.01,13.56 2.34,12.88 1.58,12.88 0.81,12.12 v1(0.81,9.54) 0.81,5.46 1.52,4.76 KEY1.2 KEY1.1 v1(12.82,4.76) KEY3.2 KEY3.1 v1(24.68,4.76) 25.95,4.76 KEY2.2 KEY2.1 v1(36.63,4.83) KEY4.2 KEY4.1 48.54,4.83 49.17,5.46 49.07,5.56 49.07,11.56 48.41,12.22 45.21,12.22 44.38,13.05 R1.1 45.7,18.01 v1(53.24,18.01) ; USB1.7 v1(2.77,34.35) USB1.8 ; USB1.8 3.05,39.94 3.05,40.36 4.06,41.38 SW1.5 3.88,46.05 1.98,46.05 1.02,47.02 1.02,53.26 1.63,53.87 3.88,53.87 SW1.4 4.06,85.67 4.72,86.33 12.24,86.33 12.85,86.94 12.85,89.1 LCD1.1 13,98.06 13.67,98.73 20.17,98.73 20.47,98.42 20.47,96.14 RP1.3 20.62,92.48 21.08,92.02 50.7,92.02 51.1,91.62 51.1,89.25 LCD1.16 52.89,89.24 53.65,89.99 v1(53.65,95.14) 53.65,95.99 54.35,96.69 D1.2 D2.2 D3.2 D4.2 D5.2 D6.2 D7.2 D8.2 84.02,96.69 84.78,95.93 84.78,72.35 84.19,71.75 v1(83.72,71.75) ; LED5.2 15.75,44.88 C4.1 15.22,49.98 C3.2 ; LED5.2 v1(18.8,44.63) 21.59,44.63 22.05,44.17 22.05,40.51 21.08,39.55 21.08,28.22 20.73,27.86 C6.2 ; 8.43,33.17 9.61,33.17 10.03,32.74 U4.1 ; v1(84.12,13.08) 84.12,3.18 83.77,2.82 82.46,2.82 B1.2 81.78,2.46 L1.1
  Bottom Layer w0.762: v1(57.25,17.96) 57.2,18.01 v1(53.24,18.01) ; v1(81.74,32.44) 81.69,32.39 v1(74.52,32.39) ; v1(83.72,71.75) 75.49,71.75 v1(75.44,71.81) ; v1(84.12,13.08) 84.07,13.13 v1(77.98,13.13)
  vias: v1(2.29,97.21) v1(2.29,95.73) v1(2.77,26.81) v1(3.86,97.21) v1(3.86,95.68) v1(16.26,16.43) v1(16.31,14.45) v1(18.29,16.38) v1(18.34,14.4) v1(36.58,97.97) v1(36.58,95.99) v1(38.61,97.97) v1(38.66,95.94) v1(84.89,95.38)
VCC: length 13.6
  Top Layer w0.762: C7.2 10.02,42.14 v1(7.62,42.14)
  Bottom Layer w0.762: SW1.2 7.22,49.96 7.42,49.76 7.42,42.34 v1(7.62,42.14)
D+: length 10.2
  Top Layer w0.381: U4.5 15.19,31.93 15.19,34.06 14.78,34.47 USB1.3
D-: length 12
  Top Layer w0.381: USB1.2 15.91,35.12 16.41,34.62 16.41,31.88 U4.6
MCU_RXD: length 59.9
  Top Layer w0.381: J1.10 U2.10 49.07,31.47 48.82,31.72 22.91,31.72 22,30.81 22,25.63 21.46,25.09 v1(13.97,25.09) ; U4.2 11.3,27.13 10.92,26.75 10.01,26.75 9.75,26.49 9.75,25.16 9.68,25.09 v1(11.07,25.09)
  Bottom Layer w0.381: v1(11.07,25.09) v1(13.97,25.09)
MCU_TXD: length 71.3
  Top Layer w0.381: v1(22.91,30.3) 22.56,29.95 22.56,23.65 21.74,22.84 10.73,22.84 R15.1 9.68,22.82 10.31,23.44 11.84,23.44 12.57,24.18 U4.3 ; J1.11 U2.11 51.61,32.33 51.26,32.69 v1(22.91,32.69)
  Bottom Layer w0.381: v1(22.91,30.3) v1(22.91,32.69)
P0.0: length 43.8
  Top Layer w0.381: U2.39 28.75,50.17 RN1.2 J2.2 28.7,88.77 LCD1.7
P0.1: length 43.8
  Top Layer w0.381: LCD1.8 30.78,53.73 J2.3 RN1.3 31.29,50.17 U2.38
P0.2: length 43.8
  Top Layer w0.381: U2.37 33.83,50.17 RN1.4 J2.4 33.32,53.73 LCD1.9
P0.3: length 43.8
  Top Layer w0.381: LCD1.10 36.32,88.77 J2.5 RN1.5 36.32,45.75 U2.36
P0.4: length 43.8
  Top Layer w0.381: LCD1.11 38.4,53.73 J2.6 RN1.6 38.91,50.17 U2.35
P0.5: length 43.8
  Top Layer w0.381: LCD1.12 41.4,88.77 J2.7 RN1.7 41.4,45.75 U2.34
P0.6: length 43.8
  Top Layer w0.381: LCD1.13 43.48,53.73 J2.8 RN1.8 43.99,50.17 U2.33
P0.7: length 43.8
  Top Layer w0.381: U2.32 46.48,45.75 RN1.9 J2.9 46.48,88.77 LCD1.14
P1.0: length 5.6
  Top Layer w0.381: U2.1 J1.1
P1.1: length 47.3
  Top Layer w0.381: U2.2 J1.2 28.65,24.71 28.65,22.12 28.04,21.51 12.19,21.51 11.31,20.63 KEY1.3 KEY1.4
P1.2: length 37.9
  Top Layer w0.381: U2.3 J1.3 31.29,22.07 30.18,20.96 23.72,20.96 23.27,20.5 23.27,8.73 KEY3.3 KEY3.4
P1.3: length 31.6
  Top Layer w0.381: KEY2.4 KEY2.3 35.02,21.95 34.7,22.28 34.09,22.28 33.83,22.53 J1.4 U2.4
P1.4: length 32.2
  Top Layer w0.381: U2.5 J1.5 36.37,22.53 36.63,22.28 37.85,22.28 38.17,21.95 KEY4.4 KEY4.3
P1.5: length 5.6
  Top Layer w0.381: U2.6 J1.6
P1.6: length 5.6
  Top Layer w0.381: U2.7 J1.7
P1.7: length 5.6
  Top Layer w0.381: J1.8 U2.8
P2.0: length 25.6
  Top Layer w0.381: R13.2 84.97,39.09 75.03,39.09 74.47,39.65 U2.21 74.42,45.75 J2.20
P2.1: length 23.6
  Top Layer w0.381: R12.2 80.5,37.97 72.49,37.97 71.93,38.53 U2.22 71.93,53.21 J2.19
P2.2: length 63.6
  Top Layer w0.381: U2.23 69.34,45.75 J2.18 69.34,55.3 69.9,55.86 77.06,55.86 79.96,58.75 v1(79.96,83.39) ; U3.14 67.77,77.92 67.77,81.31 69.8,83.34 v1(73.3,83.34)
  Bottom Layer w0.381: v1(73.3,83.34) 73.35,83.39 v1(79.96,83.39)
P2.3: length 60.5
  Top Layer w0.381: v1(73.25,82.17) 70.1,82.17 69.72,81.79 69.72,77.34 ; U2.24 66.85,53.21 J2.17 66.85,53.31 66.85,55.4 67.84,56.39 76.84,56.39 78.89,58.44 v1(78.89,82.12)
  Bottom Layer w0.381: v1(78.89,82.12) 78.84,82.17 v1(73.25,82.17)
P2.4: length 57.7
  Top Layer w0.381: v1(77.93,80.9) 77.93,58.34 76.66,57.07 65.74,57.07 64.26,55.6 J2.16 64.26,45.75 U2.25 ; v1(73.2,80.95) 71.27,80.95 70.99,80.67 U3.11
  Bottom Layer w0.381: v1(73.2,80.95) 73.2,80.9 v1(77.93,80.9)
P2.5: length 79.8
  Top Layer w0.381: U2.26 61.77,53.21 J2.15 v1(61.72,58.34) ; LCD1.6 v1(25.7,58.19)
  Bottom Layer w0.381: v1(25.7,58.19) 61.57,58.19 v1(61.72,58.34)
P2.6: length 79.7
  Top Layer w0.381: LCD1.5 23.16,57.03 v1(23.17,57.02) ; v1(59.18,57.07) J2.14 59.23,53.21 U2.27
  Bottom Layer w0.381: v1(23.17,57.02) 59.13,57.02 v1(59.18,57.07)
P2.7: length 79.5
  Top Layer w0.381: LCD1.4 20.62,55.91 v1(20.68,55.86) ; U2.28 56.69,53.21 J2.13 v1(56.64,55.8)
  Bottom Layer w0.381: v1(20.68,55.86) 56.59,55.86 v1(56.64,55.8)
P3.2: length 21.8
  Top Layer w0.381: U2.12 J1.12 54.15,21.1 55.17,20.08 55.17,17.81 55.75,17.22 56.66,17.22 57.28,16.6 57.28,13.28 57.68,12.88 R2.1
P3.3: length 5.6
  Top Layer w0.381: J1.13 U2.13
P3.4: length 5.6
  Top Layer w0.381: U2.14 J1.14
P3.5: length 5.6
  Top Layer w0.381: J1.15 U2.15
P3.6: length 5.6
  Top Layer w0.381: U2.16 J1.16
P3.7: length 36.2
  Top Layer w0.381: J1.17 U2.17 66.85,34.37 67.56,35.08 80.23,35.08 R11.1 80.26,27.97 80.92,27.31 U1.2
P4.4: length 7.6
  Top Layer w0.381: U2.29 54.15,53.21 J2.12
P4.5: length 7.6
  Top Layer w0.381: J2.11 51.61,53.21 U2.30
Q0: length 22
  Top Layer w0.381: U3.15 65.89,77.31 v1(65.89,75.87) ; v1(57.86,75.87) 56.19,75.87 55.69,76.37 R3.1
  Bottom Layer w0.381: v1(57.86,75.87) v1(65.89,75.87)
Q1: length 20.3
  Top Layer w0.381: R4.1 58.73,72.25 59.12,71.86 U3.1
Q2: length 18
  Top Layer w0.381: 61.78,86.46 61.78,74.29 62.79,73.28 65.74,73.28 65.89,73.13 65.89,71.89 U3.2
Q3: length 19.4
  Top Layer w0.381: 64.83,86.46 64.83,83.55 62.71,81.43 62.71,74.47 62.75,74.43 62.71,74.42 63.29,73.84 66.7,73.84 67.18,73.36 U3.3
Q4: length 21.3
  Top Layer w0.381: U3.4 68.45,74.17 68.17,74.45 63.65,74.45 63.25,74.85 63.25,80.22 67.88,84.85 67.88,86.46
Q5: length 23.1
  Top Layer w0.381: 69.72,71.86 69.72,74.22 68.94,75.01 64.24,75.01 63.86,75.39 63.86,80.07 69.61,85.83 70.29,85.83 70.93,86.46
Q6: length 18.3
  Top Layer w0.381: U3.6 70.97,71.89 70.97,73.43 71.17,73.64 74.57,73.64 74.57,85.86 73.97,86.46
Q7: length 24.3
  Top Layer w0.381: 77.02,86.46 77.02,69.83 76.2,69.01 72.8,69.01 72.26,69.55 U3.7
RST: length 51.5
  Top Layer w0.381: U2.9 J1.9 46.53,21.77 47.19,21.11 53.39,21.11 54.61,19.89 54.61,16.76 R1.2 ; R1.2 54.68,13.96 54.31,13.59 51.41,13.59 51.1,13.28 51.1,11.31 RST.2 RST.1 ; R1.2 56.44,16.69 56.74,16.38 56.74,9.88 57.3,9.32 60.94,9.32 C1.2
X1: length 16.2
  Top Layer w0.254: C2.1 73.15,16.29 X1.2 70.92,22.73 70.92,24.73 71.01,24.82 J1.19
  Top Layer w0.381: U2.19 J1.19
X2: length 16.3
  Top Layer w0.254: J1.18 70.42,24.82 70.51,24.73 70.51,22.73 X1.1 68.27,16.27 C5.2
  Top Layer w0.381: U2.18 J1.18
$1N507: length 6.8
  Bottom Layer w0.381: RP1.2 18.08,89.25 LCD1.3
$1N544: length 6.1
  Top Layer w0.381: D1.1 55.67,88.51 R3.2
$1N555: length 6.1
  Top Layer w0.381: R4.2 58.71,88.51 D2.1
$1N566: length 6.1
  Top Layer w0.381: 61.78,88.49 61.76,88.51 D3.1
$1N577: length 6.1
  Top Layer w0.381: 64.83,88.49 64.81,88.51 D4.1
$1N588: length 6.1
  Top Layer w0.381: 67.88,88.49 67.86,88.51 D5.1
$1N599: length 6.1
  Top Layer w0.381: 70.93,88.49 70.91,88.51 D6.1
$1N610: length 6.1
  Top Layer w0.381: 73.97,88.49 73.95,88.51 D7.1
$1N621: length 6.1
  Top Layer w0.381: D8.1 77,88.51 77.02,88.49
$1N777: length 4
  Top Layer w0.381: C6.1 13.96,31.74 13.84,31.85
$1N811: length 2.5
  Top Layer w0.381: LED3.1 7.63,25.07 7.65,25.09
$1N822: length 2.5
  Top Layer w0.381: R15.2 7.63,21.77 LED4.1
$1N842: length 2.4
  Top Layer w0.381: LED2.2 R13.1
$1N843: length 2.7
  Top Layer w0.381: LED1.2 R12.1
$1N921: length 4.7
  Top Layer w0.381: LED5.1 20.25,42.09 R16.2
$1N2085: length 7.7
  Bottom Layer w0.381: Q1.2 70.16,8.76 71.83,8.76 72.03,8.97 72.03,12.68 71.83,12.88 R2.2
$1N2102: length 25.8
  Top Layer w0.381: B1.1 82.3,8.1 81.74,7.54 Q1.3 64.67,7.54 63.82,6.69 L1.2

## Copper pours and planes (outline as drawn; the poured copper is in the pictures)
+5V on Top Layer: 3.1,54.13 27.03,54.13 27.03,44.78 3.1,44.78
+5V on Top Layer: 48.06,54.13 49.94,54.13 49.94,44.73 48.06,44.73
+5V on Top Layer: 14.38,96.8 16.56,96.8 16.56,88.01 14.38,88.01
+5V on Top Layer: 79.6,54.38 86.77,54.38 86.77,52.55 79.6,52.55
+5V on Top Layer: 79.45,25.58 86.66,25.58 86.66,23.9 79.45,23.9
+5V on Top Layer: 54.41,12.27 61.67,12.27 61.67,1.19 54.41,1.19
GND on Top Layer: -1.09,102.39 93.52,102.39 93.52,-2.41 -1.09,-2.41
GND on Bottom Layer: -7.75,103.71 99.49,103.71 99.49,-14.86 -7.75,-14.86
VCC on Top Layer: 6.4,43.08 10.87,43.08 10.87,35.48 6.4,35.48

Small or netless copper shapes (teardrops, artwork), in the pictures only: 333 on Top Layer, 29 on Bottom Layer

## Text on the board
Top Silkscreen Layer: P1.0 | P1.1 | P1.2 | P1.3 | P1.4 | P1.5 | P1.6 | P1.7 | RST | RXD | TXD | P3.2 | P3.3 | P3.4 | P3.5 | P3.6 | P3.7 | X2 | X1 | GND | +5V | P0.0 | P0.1 | P0.2 | P0.3 | P0.4 | P0.5 | P0.6 | P0.7 | P4.5 | P4.4 | P2.7 | P2.6 | P2.5 | P2.4 | P2.3 | P2.2 | P2.1 | P2.0
